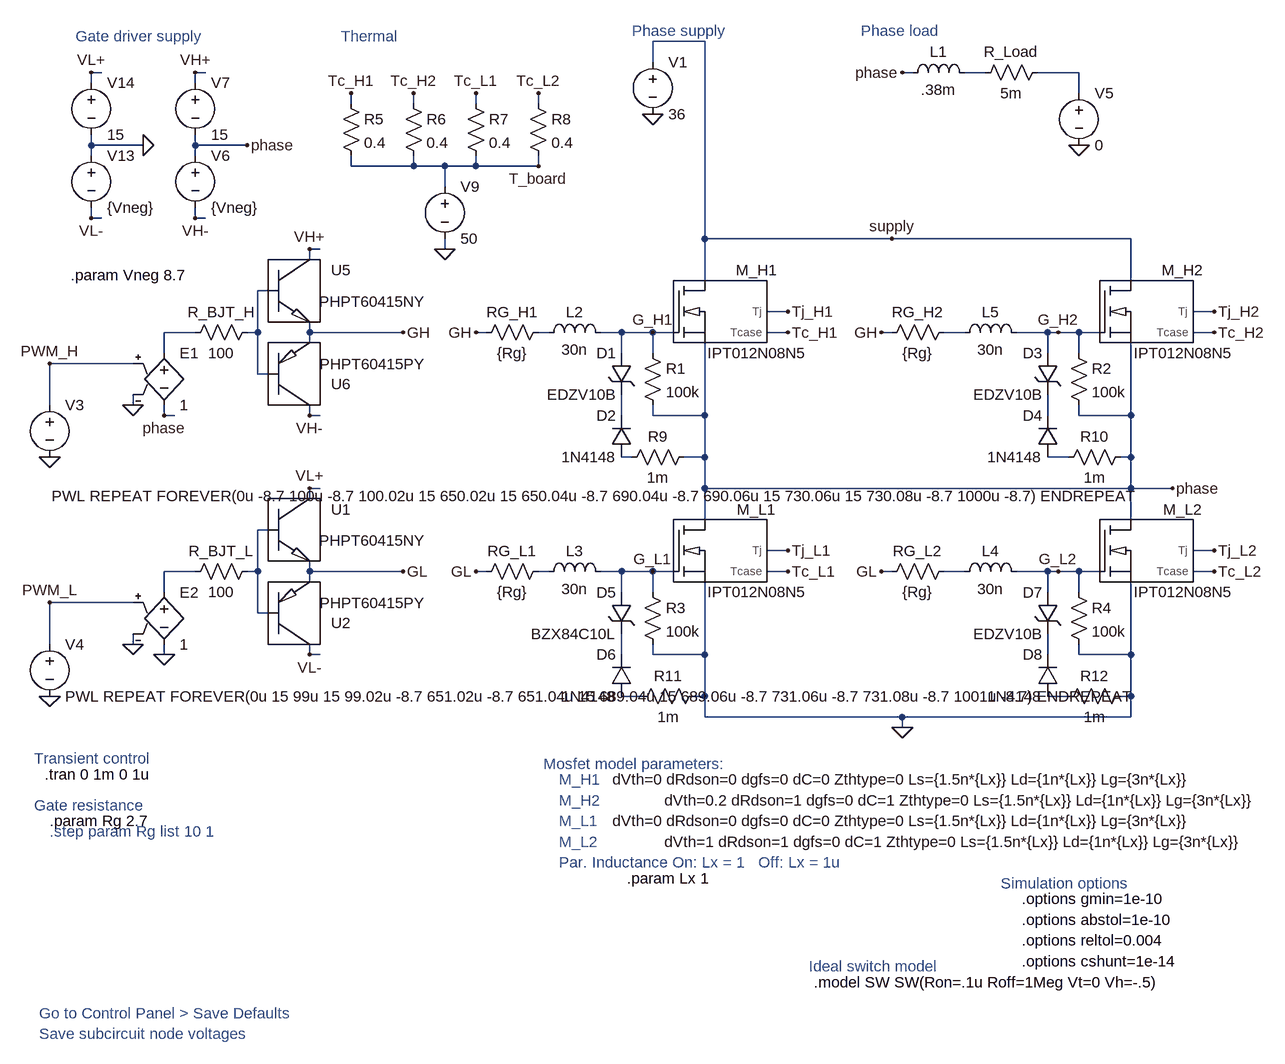
[diagram p0: schematic Gate_drive_Double_pulse_80V.asc]
Gate_drive_Double_pulse_80V.asc, the LTspice schematic file:
Version 4
SHEET 1 5608 1392
WIRE 816 -624 736 -624
WIRE 736 -592 736 -624
WIRE -112 -576 -128 -576
WIRE 48 -576 32 -576
WIRE 1136 -576 1120 -576
WIRE 1248 -576 1216 -576
WIRE 1392 -576 1328 -576
WIRE -128 -560 -128 -576
WIRE 32 -560 32 -576
WIRE 1392 -544 1392 -576
WIRE 272 -528 272 -544
WIRE 368 -528 368 -544
WIRE 464 -528 464 -544
WIRE 560 -528 560 -544
WIRE -128 -464 -128 -480
WIRE -48 -464 -128 -464
WIRE 32 -464 32 -480
WIRE 112 -464 32 -464
WIRE -128 -448 -128 -464
WIRE 32 -448 32 -464
WIRE 272 -432 272 -448
WIRE 368 -432 368 -448
WIRE 368 -432 272 -432
WIRE 416 -432 368 -432
WIRE 464 -432 464 -448
WIRE 464 -432 416 -432
WIRE 560 -432 560 -448
WIRE 560 -432 464 -432
WIRE 416 -400 416 -432
WIRE -128 -352 -128 -368
WIRE -112 -352 -128 -352
WIRE 32 -352 32 -368
WIRE 48 -352 32 -352
WIRE 816 -320 816 -624
WIRE 1104 -320 816 -320
WIRE 1472 -320 1104 -320
WIRE 224 -304 208 -304
WIRE 416 -304 416 -320
WIRE 208 -288 208 -304
WIRE 816 -256 816 -320
WIRE 1472 -256 1472 -320
WIRE 144 -240 128 -240
WIRE 944 -208 912 -208
WIRE 1600 -208 1568 -208
WIRE 32 -176 -16 -176
WIRE 128 -176 128 -240
WIRE 128 -176 112 -176
WIRE 208 -176 208 -192
WIRE 352 -176 208 -176
WIRE 480 -176 464 -176
WIRE 576 -176 560 -176
WIRE 688 -176 656 -176
WIRE 736 -176 688 -176
WIRE 768 -176 736 -176
WIRE 944 -176 912 -176
WIRE 1104 -176 1088 -176
WIRE 1216 -176 1184 -176
WIRE 1344 -176 1296 -176
WIRE 1360 -176 1344 -176
WIRE 1392 -176 1360 -176
WIRE 1424 -176 1392 -176
WIRE 1600 -176 1568 -176
WIRE 208 -160 208 -176
WIRE -16 -144 -16 -176
WIRE 688 -144 688 -176
WIRE 736 -144 736 -176
WIRE 1344 -144 1344 -176
WIRE 1392 -144 1392 -176
WIRE -64 -128 -192 -128
WIRE 128 -112 128 -176
WIRE 144 -112 128 -112
WIRE -192 -64 -192 -128
WIRE -64 -64 -64 -80
WIRE -16 -48 -16 -64
WIRE 0 -48 -16 -48
WIRE 208 -48 208 -64
WIRE 224 -48 208 -48
WIRE 688 -48 688 -80
WIRE 736 -48 736 -64
WIRE 816 -48 816 -160
WIRE 816 -48 736 -48
WIRE 1344 -48 1344 -80
WIRE 1392 -48 1392 -64
WIRE 1472 -48 1472 -160
WIRE 1472 -48 1392 -48
WIRE 704 16 688 16
WIRE 816 16 816 -48
WIRE 816 16 784 16
WIRE 1376 16 1344 16
WIRE 1472 16 1472 -48
WIRE 1472 16 1456 16
WIRE 224 64 208 64
WIRE 816 64 816 16
WIRE 1472 64 1472 16
WIRE 1472 64 816 64
WIRE 1536 64 1472 64
WIRE 208 80 208 64
WIRE 816 112 816 64
WIRE 1472 112 1472 64
WIRE 144 128 128 128
WIRE 944 160 912 160
WIRE 1600 160 1568 160
WIRE 32 192 -16 192
WIRE 128 192 128 128
WIRE 128 192 112 192
WIRE 208 192 208 176
WIRE 352 192 208 192
WIRE 480 192 464 192
WIRE 576 192 560 192
WIRE 688 192 656 192
WIRE 736 192 688 192
WIRE 768 192 736 192
WIRE 944 192 912 192
WIRE 1104 192 1088 192
WIRE 1216 192 1184 192
WIRE 1344 192 1296 192
WIRE 1360 192 1344 192
WIRE 1392 192 1360 192
WIRE 1424 192 1392 192
WIRE 1600 192 1568 192
WIRE 208 208 208 192
WIRE -16 224 -16 192
WIRE 688 224 688 192
WIRE 736 224 736 192
WIRE 1344 224 1344 192
WIRE 1392 224 1392 192
WIRE -64 240 -192 240
WIRE 128 256 128 192
WIRE 144 256 128 256
WIRE -192 304 -192 240
WIRE -64 304 -64 288
WIRE -16 320 -16 304
WIRE 208 320 208 304
WIRE 224 320 208 320
WIRE 688 320 688 288
WIRE 736 320 736 304
WIRE 816 320 816 208
WIRE 816 320 736 320
WIRE 1344 320 1344 288
WIRE 1392 320 1392 304
WIRE 1472 320 1472 208
WIRE 1472 320 1392 320
WIRE 720 384 688 384
WIRE 816 384 816 320
WIRE 816 384 800 384
WIRE 1376 384 1344 384
WIRE 1472 384 1472 320
WIRE 1472 384 1456 384
WIRE 816 416 816 384
WIRE 1120 416 816 416
WIRE 1472 416 1472 384
WIRE 1472 416 1120 416
WIRE 1120 432 1120 416
FLAG 464 -176 GH
FLAG 736 -176 G_H1
FLAG 1088 -176 GH
FLAG 1360 -176 G_H2
FLAG 736 -512 0
FLAG 464 192 GL
FLAG 736 192 G_L1
FLAG 1088 192 GL
FLAG 1360 192 G_L2
FLAG 1120 432 0
FLAG 1536 64 phase
FLAG -192 16 0
FLAG -64 -64 0
FLAG -16 -48 phase
FLAG 352 -176 GH
FLAG 352 192 GL
FLAG 1392 -464 0
FLAG 1120 -576 phase
FLAG 112 -464 phase
FLAG -192 384 0
FLAG 1600 -208 Tj_H2
FLAG 944 -208 Tj_H1
FLAG 1600 -176 Tc_H2
FLAG 944 -176 Tc_H1
FLAG 944 160 Tj_L1
FLAG 944 192 Tc_L1
FLAG 1600 160 Tj_L2
FLAG 1600 192 Tc_L2
FLAG 32 -576 VH+
FLAG 32 -352 VH-
FLAG -128 -576 VL+
FLAG -128 -352 VL-
FLAG -48 -464 0
FLAG 208 -304 VH+
FLAG 208 -48 VH-
FLAG -64 304 0
FLAG 208 64 VL+
FLAG 208 320 VL-
FLAG 416 -304 0
FLAG 560 -432 T_board
FLAG 272 -544 Tc_H1
FLAG 368 -544 Tc_H2
FLAG 464 -544 Tc_L1
FLAG 560 -544 Tc_L2
FLAG 1104 -320 supply
FLAG -16 320 0
FLAG -192 -128 PWM_H
FLAG -192 240 PWM_L
SYMBOL IPT012N08N5 832 -208 R0
WINDOW 39 -158 720 Left 2
SYMATTR SpiceLine dVth=0 dRdson=0 dgfs=0 dC=0 Zthtype=0 Ls={1.5n*{Lx}} Ld={1n*{Lx}} Lg={3n*{Lx}}
SYMATTR InstName M_H1
SYMBOL res 464 -160 R270
WINDOW 0 32 56 VTop 2
WINDOW 3 0 56 VBottom 2
SYMATTR InstName RG_H1
SYMATTR Value {Rg}
SYMBOL IPT012N08N5 1488 -208 R0
WINDOW 39 -734 752 Left 2
SYMATTR SpiceLine dVth=0.2 dRdson=1 dgfs=0 dC=1 Zthtype=0 Ls={1.5n*{Lx}} Ld={1n*{Lx}} Lg={3n*{Lx}}
SYMATTR InstName M_H2
SYMBOL res 1088 -160 R270
WINDOW 0 32 56 VTop 2
WINDOW 3 0 56 VBottom 2
SYMATTR InstName RG_H2
SYMATTR Value {Rg}
SYMBOL voltage 736 -608 R0
WINDOW 123 0 0 Left 2
WINDOW 39 0 0 Left 2
SYMATTR InstName V1
SYMATTR Value 36
SYMBOL IPT012N08N5 832 160 R0
WINDOW 39 -158 416 Left 2
SYMATTR SpiceLine dVth=0 dRdson=0 dgfs=0 dC=0 Zthtype=0 Ls={1.5n*{Lx}} Ld={1n*{Lx}} Lg={3n*{Lx}}
SYMATTR InstName M_L1
SYMBOL res 464 208 R270
WINDOW 0 32 56 VTop 2
WINDOW 3 0 56 VBottom 2
SYMATTR InstName RG_L1
SYMATTR Value {Rg}
SYMBOL IPT012N08N5 1488 160 R0
WINDOW 39 -734 448 Left 2
SYMATTR SpiceLine dVth=1 dRdson=1 dgfs=0 dC=1 Zthtype=0 Ls={1.5n*{Lx}} Ld={1n*{Lx}} Lg={3n*{Lx}}
SYMATTR InstName M_L2
SYMBOL res 1088 208 R270
WINDOW 0 32 56 VTop 2
WINDOW 3 0 56 VBottom 2
SYMATTR InstName RG_L2
SYMATTR Value {Rg}
SYMBOL voltage -192 -80 R0
WINDOW 123 0 0 Left 2
WINDOW 39 0 0 Left 2
WINDOW 3 3 156 Left 2
SYMATTR Value PWL REPEAT FOREVER(0u -8.7 100u -8.7 100.02u 15 650.02u 15 650.04u -8.7 690.04u -8.7 690.06u 15 730.06u 15 730.08u -8.7 1000u -8.7) ENDREPEAT
SYMATTR InstName V3
SYMBOL e -16 -160 R0
SYMATTR InstName E1
SYMATTR Value 1
SYMBOL voltage -192 288 R0
WINDOW 123 0 0 Left 2
WINDOW 39 0 0 Left 2
SYMATTR InstName V4
SYMATTR Value PWL REPEAT FOREVER(0u 15 99u 15 99.02u -8.7 651.02u -8.7 651.04u 15 689.04u 15 689.06u -8.7 731.06u -8.7 731.08u -8.7 1001u -8.7) ENDREPEAT
SYMBOL ind 1120 -560 R270
WINDOW 0 32 56 VTop 2
WINDOW 3 5 56 VBottom 2
SYMATTR InstName L1
SYMATTR Value .38m
SYMBOL res 1232 -560 R270
WINDOW 0 32 56 VTop 2
WINDOW 3 0 56 VBottom 2
SYMATTR InstName R_Load
SYMATTR Value 5m
SYMBOL voltage 1392 -560 R0
WINDOW 123 0 0 Left 2
WINDOW 39 0 0 Left 2
SYMATTR InstName V5
SYMATTR Value 0
SYMBOL PHPT60415NY 192 -240 R0
SYMATTR InstName U5
SYMBOL PHPT60415PY 192 -112 M180
SYMATTR InstName U6
SYMBOL voltage 32 -464 R0
WINDOW 123 0 0 Left 2
WINDOW 39 0 0 Left 2
SYMATTR InstName V6
SYMATTR Value {Vneg}
SYMBOL voltage 32 -576 R0
WINDOW 123 0 0 Left 2
WINDOW 39 0 0 Left 2
SYMATTR InstName V7
SYMATTR Value 15
SYMBOL res 128 -192 R90
WINDOW 0 0 56 VBottom 2
WINDOW 3 32 56 VTop 2
SYMATTR InstName R_BJT_H
SYMATTR Value 100
SYMBOL res 1376 -160 R0
SYMATTR InstName R2
SYMATTR Value 100k
SYMBOL zener 704 -144 M0
SYMATTR InstName D1
SYMATTR Value EDZV10B
SYMATTR Description Diode
SYMATTR Type diode
SYMBOL diode 704 16 R180
WINDOW 0 24 64 Left 2
WINDOW 3 24 0 Left 2
SYMATTR InstName D2
SYMATTR Value 1N4148
SYMBOL voltage -128 -464 R0
WINDOW 123 0 0 Left 2
WINDOW 39 0 0 Left 2
SYMATTR InstName V13
SYMATTR Value {Vneg}
SYMBOL voltage -128 -576 R0
WINDOW 123 0 0 Left 2
WINDOW 39 0 0 Left 2
SYMATTR InstName V14
SYMATTR Value 15
SYMBOL e -16 208 R0
SYMATTR InstName E2
SYMATTR Value 1
SYMBOL PHPT60415NY 192 128 R0
SYMATTR InstName U1
SYMBOL PHPT60415PY 192 256 M180
SYMATTR InstName U2
SYMBOL res 128 176 R90
WINDOW 0 0 56 VBottom 2
WINDOW 3 32 56 VTop 2
SYMATTR InstName R_BJT_L
SYMATTR Value 100
SYMBOL voltage 416 -416 R0
WINDOW 123 0 0 Left 2
WINDOW 39 0 0 Left 2
SYMATTR InstName V9
SYMATTR Value 50
SYMBOL res 256 -544 R0
SYMATTR InstName R5
SYMATTR Value 0.4
SYMBOL res 352 -544 R0
SYMATTR InstName R6
SYMATTR Value 0.4
SYMBOL res 448 -544 R0
SYMATTR InstName R7
SYMATTR Value 0.4
SYMBOL res 544 -544 R0
SYMATTR InstName R8
SYMATTR Value 0.4
SYMBOL zener 1360 -144 M0
SYMATTR InstName D3
SYMATTR Value EDZV10B
SYMATTR Description Diode
SYMATTR Type diode
SYMBOL diode 1360 16 R180
WINDOW 0 24 64 Left 2
WINDOW 3 24 0 Left 2
SYMATTR InstName D4
SYMATTR Value 1N4148
SYMBOL zener 704 224 M0
SYMATTR InstName D5
SYMATTR Value BZX84C10L
SYMATTR Description Diode
SYMATTR Type diode
SYMBOL diode 704 384 R180
WINDOW 0 24 64 Left 2
WINDOW 3 24 0 Left 2
SYMATTR InstName D6
SYMATTR Value 1N4148
SYMBOL zener 1360 224 M0
SYMATTR InstName D7
SYMATTR Value EDZV10B
SYMATTR Description Diode
SYMATTR Type diode
SYMBOL diode 1360 384 R180
WINDOW 0 24 64 Left 2
WINDOW 3 24 0 Left 2
SYMATTR InstName D8
SYMATTR Value 1N4148
SYMBOL res 720 -160 R0
SYMATTR InstName R1
SYMATTR Value 100k
SYMBOL res 720 208 R0
SYMATTR InstName R3
SYMATTR Value 100k
SYMBOL res 1376 208 R0
SYMATTR InstName R4
SYMATTR Value 100k
SYMBOL res 800 0 R90
WINDOW 0 0 56 VBottom 2
WINDOW 3 32 56 VTop 2
SYMATTR InstName R9
SYMATTR Value 1m
SYMBOL res 1472 0 R90
WINDOW 0 0 56 VBottom 2
WINDOW 3 32 56 VTop 2
SYMATTR InstName R10
SYMATTR Value 1m
SYMBOL res 816 368 R90
WINDOW 0 0 56 VBottom 2
WINDOW 3 32 56 VTop 2
SYMATTR InstName R11
SYMATTR Value 1m
SYMBOL res 1472 368 R90
WINDOW 0 0 56 VBottom 2
WINDOW 3 32 56 VTop 2
SYMATTR InstName R12
SYMATTR Value 1m
SYMBOL ind 560 -160 R270
WINDOW 0 32 56 VTop 2
WINDOW 3 5 56 VBottom 2
SYMATTR InstName L2
SYMATTR Value 30n
SYMBOL ind 560 208 R270
WINDOW 0 32 56 VTop 2
WINDOW 3 5 56 VBottom 2
SYMATTR InstName L3
SYMATTR Value 30n
SYMBOL ind 1200 208 R270
WINDOW 0 32 56 VTop 2
WINDOW 3 5 56 VBottom 2
SYMATTR InstName L4
SYMATTR Value 30n
SYMBOL ind 1200 -160 R270
WINDOW 0 32 56 VTop 2
WINDOW 3 5 56 VBottom 2
SYMATTR InstName L5
SYMATTR Value 30n
TEXT -200 504 Left 2 !.tran 0 1m 0 1u
TEXT 1304 792 Left 2 !.options cshunt=1e-14
TEXT 1304 696 Left 2 !.options gmin=1e-10
TEXT 1304 728 Left 2 !.options abstol=1e-10
TEXT 1304 760 Left 2 !.options reltol=0.004
TEXT 984 824 Left 2 !.model SW SW(Ron=.1u Roff=1Meg Vt=0 Vh=-.5)
TEXT -192 576 Left 2 !.param Rg 2.7
TEXT 696 664 Left 2 !.param Lx 1
TEXT 592 512 Left 2 ;M_H1
TEXT 592 544 Left 2 ;M_H2
TEXT 592 576 Left 2 ;M_L1
TEXT 592 608 Left 2 ;M_L2
TEXT 592 640 Left 2 ;Par. Inductance On: Lx = 1   Off: Lx = 1u
TEXT -216 552 Left 2 ;Gate resistance
TEXT 568 488 Left 2 ;Mosfet model parameters:
TEXT 256 -632 Left 2 ;Thermal
TEXT -152 -632 Left 2 ;Gate driver supply
TEXT 704 -640 Left 2 ;Phase supply
TEXT 1056 -640 Left 2 ;Phase load
TEXT 1272 672 Left 2 ;Simulation options
TEXT -216 480 Left 2 ;Transient control
TEXT 976 800 Left 2 ;Ideal switch model
TEXT -192 592 Left 2 ;.step param Rg list 10 1
TEXT -208 872 Left 2 ;Go to Control Panel > Save Defaults\nSave subcircuit node voltages
TEXT -160 -264 Left 2 !.param Vneg 8.7

The netlist it stands for:
* Gate_drive_Double_pulse_80V.asc
XM_H1 supply G_H1 phase Tj_H1 Tc_H1 IPT012N08N5 dVth=0 dRdson=0 dgfs=0 dC=0 Zthtype=0 Ls={1.5n*{Lx}} Ld={1n*{Lx}} Lg={3n*{Lx}}  ; pins drain gate source Tj Tcase
RG_H1 GH N005 {Rg}
XM_H2 supply G_H2 phase Tj_H2 Tc_H2 IPT012N08N5 dVth=0.2 dRdson=1 dgfs=0 dC=1 Zthtype=0 Ls={1.5n*{Lx}} Ld={1n*{Lx}} Lg={3n*{Lx}}  ; pins drain gate source Tj Tcase
RG_H2 GH N006 {Rg}
V1 supply 0 36
XM_L1 phase G_L1 0 Tj_L1 Tc_L1 IPT012N08N5 dVth=0 dRdson=0 dgfs=0 dC=0 Zthtype=0 Ls={1.5n*{Lx}} Ld={1n*{Lx}} Lg={3n*{Lx}}  ; pins drain gate source Tj Tcase
RG_L1 GL N013 {Rg}
XM_L2 phase G_L2 0 Tj_L2 Tc_L2 IPT012N08N5 dVth=1 dRdson=1 dgfs=0 dC=1 Zthtype=0 Ls={1.5n*{Lx}} Ld={1n*{Lx}} Lg={3n*{Lx}}  ; pins drain gate source Tj Tcase
RG_L2 GL N014 {Rg}
V3 PWM_H 0 PWL REPEAT FOREVER(0u -8.7 100u -8.7 100.02u 15 650.02u 15 650.04u -8.7 690.04u -8.7 690.06u 15 730.06u 15 730.08u -8.7 1000u -8.7) ENDREPEAT
E1 N004 phase PWM_H 0 1
V4 PWM_L 0 PWL REPEAT FOREVER(0u 15 99u 15 99.02u -8.7 651.02u -8.7 651.04u 15 689.04u 15 689.06u -8.7 731.06u -8.7 731.08u -8.7 1001u -8.7) ENDREPEAT
L1 phase N001 .38m
R_Load N001 N002 5m
V5 N002 0 0
XU5 VH+ N003 GH PHPT60415NY  ; pins 1 2 3
XU6 VH- N003 GH PHPT60415PY  ; pins 1 2 3
V6 phase VH- {Vneg}
V7 VH+ phase 15
R_BJT_H N003 N004 100
R2 G_H2 phase 100k
D1 G_H1 N007 EDZV10B
D2 N009 N007 1N4148
V13 0 VL- {Vneg}
V14 VL+ 0 15
E2 N012 0 PWM_L 0 1
XU1 VL+ N011 GL PHPT60415NY  ; pins 1 2 3
XU2 VL- N011 GL PHPT60415PY  ; pins 1 2 3
R_BJT_L N011 N012 100
V9 T_board 0 50
R5 Tc_H1 T_board 0.4
R6 Tc_H2 T_board 0.4
R7 Tc_L1 T_board 0.4
R8 Tc_L2 T_board 0.4
D3 G_H2 N008 EDZV10B
D4 N010 N008 1N4148
D5 G_L1 N015 BZX84C10L
D6 N017 N015 1N4148
D7 G_L2 N016 EDZV10B
D8 N018 N016 1N4148
R1 G_H1 phase 100k
R3 G_L1 0 100k
R4 G_L2 0 100k
R9 phase N009 1m
R10 phase N010 1m
R11 0 N017 1m
R12 0 N018 1m
L2 N005 G_H1 30n
L3 N013 G_L1 30n
L4 N014 G_L2 30n
L5 N006 G_H2 30n
.model D D
.lib standard.dio
.tran 0 1m 0 1u
.options cshunt=1e-14
.options gmin=1e-10
.options abstol=1e-10
.options reltol=0.004
.model SW SW(Ron=.1u Roff=1Meg Vt=0 Vh=-.5)
.param Rg 2.7
.param Lx 1
* M_H1
* M_H2
* M_L1
* M_L2
* Par. Inductance On: Lx = 1   Off: Lx = 1u
* Gate resistance
* Mosfet model parameters:
* Thermal
* Gate driver supply
* Phase supply
* Phase load
* Simulation options
* Transient control
* Ideal switch model
* .step param Rg list 10 1
* Go to Control Panel > Save Defaults
* Save subcircuit node voltages
.param Vneg 8.7
.lib OptiMOS5_80V_PSpice.lib
.lib PHPT60415NY.lib
.lib PHPT60415PY.lib
.backanno
.end